# EAGLE schematic Rev 1 (EAGLE 9.2.2)

## Sheet 1 of 12: FPGA
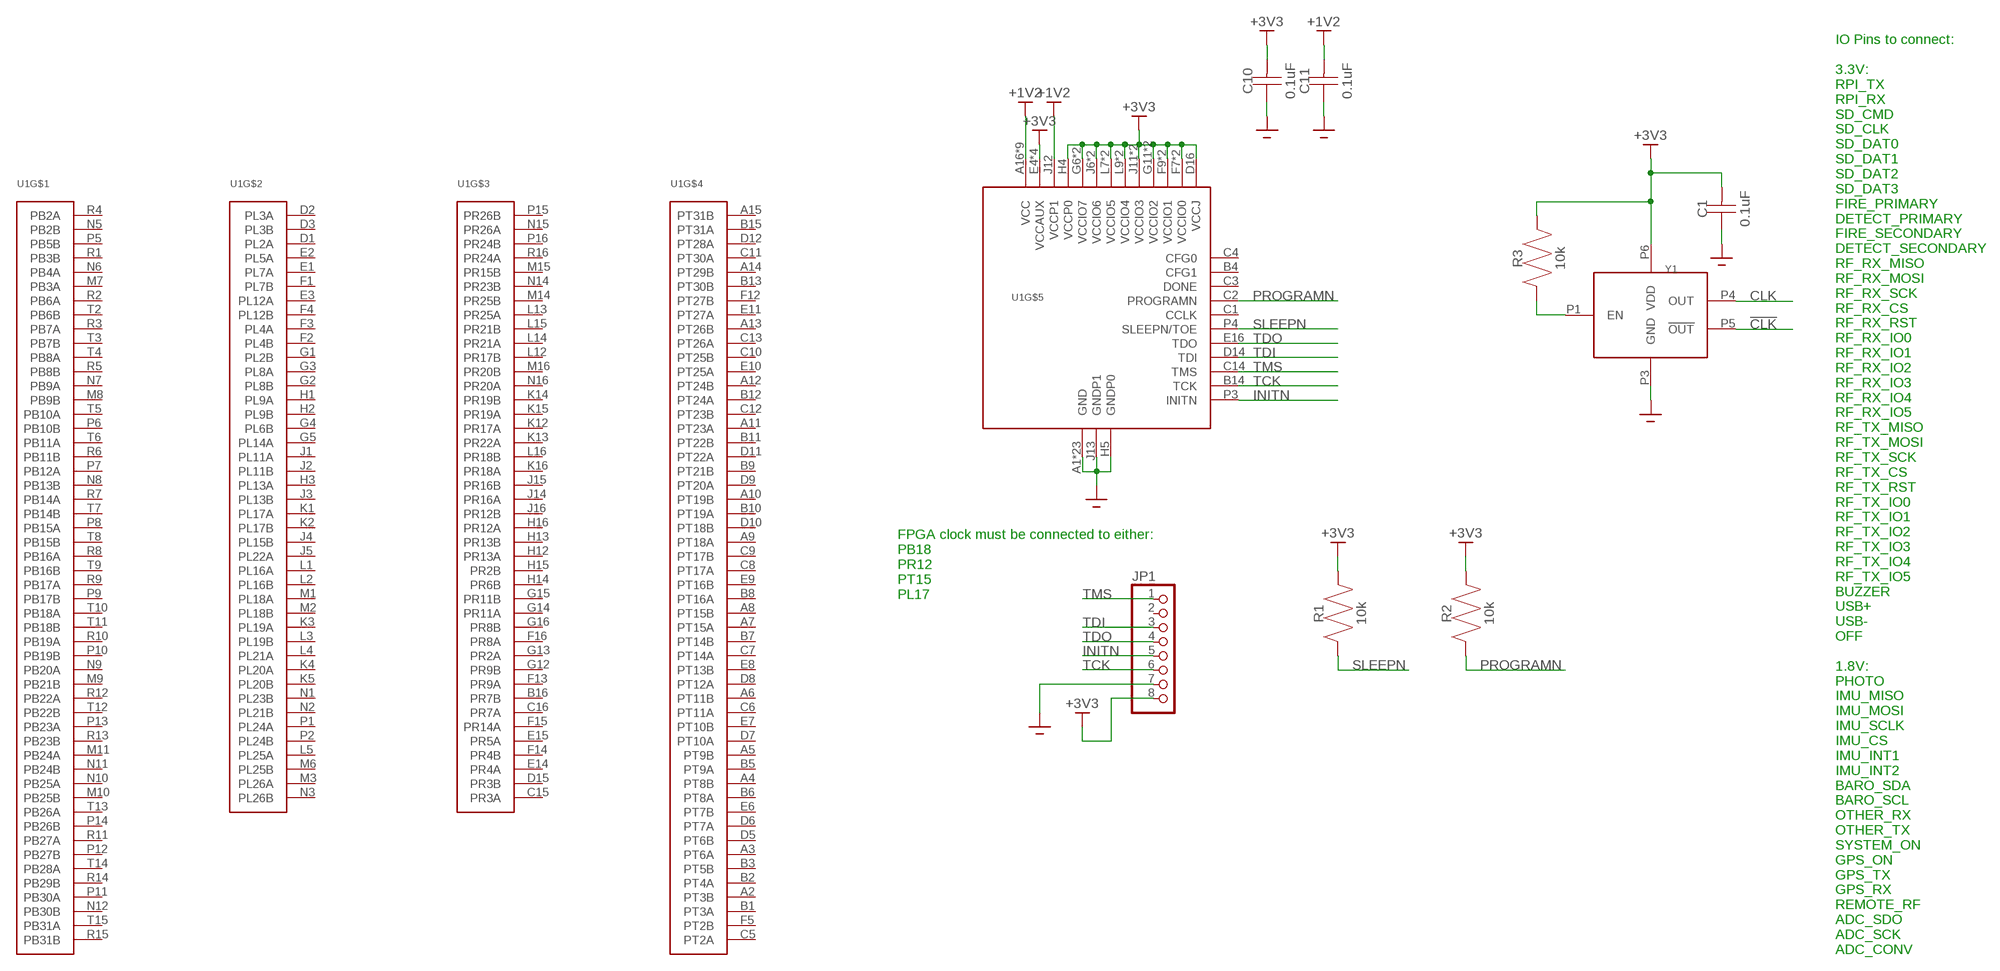
[diagram p0: schematic, sheet 1]

### Parts
C1  0.1uF  CAPACITOR0805  [0805]
C10  0.1uF  CAPACITOR0805  [0805]
C11  0.1uF  CAPACITOR0805  [0805]
JP1  PINHD-1X8  [1X08]
R1  10k  RESISTOR0805  [0805]
R2  10k  RESISTOR0805  [0805]
R3  10k  RESISTOR0805  [0805]
U1  LFXP6E-3FN256C  [FBGA256]
Y1  DSC1122B  [ICDFN500X320X90-4]

### Nets
!CLK: Y1.P5(!OUT)
+1V2: C11.P$2 U1.A16(VCC) U1.D4(VCC) U1.D13(VCC) U1.E5(VCC) U1.E12(VCC) U1.J12(VCCP1) U1.M5(VCC) U1.M12(VCC) U1.N4(VCC) U1.N13(VCC) ; also sheet 8,12
+3V3: C1.P$2 C10.P$2 JP1.8 R1.P$2 R2.P$2 R3.P$2 U1.D16(VCCJ) U1.E4(VCCAUX) U1.E13(VCCAUX) U1.F7(VCCIO0) U1.F8(VCCIO0) U1.F9(VCCIO1) U1.F10(VCCIO1) U1.G6(VCCIO7) U1.G11(VCCIO2) U1.H4(VCCP0) U1.H6(VCCIO7) U1.H11(VCCIO2) U1.J6(VCCIO6) U1.J11(VCCIO3) U1.K6(VCCIO6) U1.K11(VCCIO3) U1.L7(VCCIO5) U1.L8(VCCIO5) U1.L9(VCCIO4) U1.L10(VCCIO4) U1.M4(VCCAUX) U1.M13(VCCAUX) Y1.P6(VDD) ; also sheet 3,4,8,12
CLK: Y1.P4(OUT)
GND: C1.P$1 C10.P$1 C11.P$1 JP1.7 U1.A1(GND) U1.F6(GND) U1.F11(GND) U1.G7(GND) U1.G8(GND) U1.G9(GND) U1.G10(GND) U1.H5(GNDP0) U1.H7(GND) U1.H8(GND) U1.H9(GND) U1.H10(GND) U1.J7(GND) U1.J8(GND) U1.J9(GND) U1.J10(GND) U1.J13(GNDP1) U1.K7(GND) U1.K8(GND) U1.K9(GND) U1.K10(GND) U1.L6(GND) U1.L11(GND) U1.T1(GND) U1.T16(GND) Y1.P3(GND) ; also sheet 2,3,4,5,6,7,8,9,10,11,12
INITN: JP1.5 U1.P3(INITN)
N$1: R3.P$1 Y1.P1(EN)
PROGRAMN: R2.P$1 U1.C2(PROGRAMN)
SLEEPN: R1.P$1 U1.P4(SLEEPN/TOE)
TCK: JP1.6 U1.B14(TCK)
TDI: JP1.3 U1.D14(TDI)
TDO: JP1.4 U1.E16(TDO)
TMS: JP1.1 U1.C14(TMS)
Unconnected: JP1.2 U1.A2(PT3B) U1.A3(PT6A) U1.A4(PT8B) U1.A5(PT9B) U1.A6(PT11B) U1.A7(PT15A) U1.A8(PT15B) U1.A9(PT18A) U1.A10(PT19B) U1.A11(PT23A) U1.A12(PT24B) U1.A13(PT26B) U1.A14(PT29B) U1.A15(PT31B) U1.B1(PT3A) U1.B2(PT4A) U1.B3(PT5B) U1.B4(CFG1) U1.B5(PT9A) U1.B6(PT8A) U1.B7(PT14B) U1.B8(PT16A) U1.B9(PT21B) U1.B10(PT19A) U1.B11(PT22B) U1.B12(PT24A) U1.B13(PT30B) U1.B15(PT31A) U1.B16(PR7B) U1.C1(CCLK) U1.C3(DONE) U1.C4(CFG0) U1.C5(PT2A) U1.C6(PT11A) U1.C7(PT14A) U1.C8(PT17A) U1.C9(PT17B) U1.C10(PT25B) U1.C11(PT30A) U1.C12(PT23B) U1.C13(PT26A) U1.C15(PR3A) U1.C16(PR7A) U1.D1(PL2A) U1.D2(PL3A) U1.D3(PL3B) U1.D5(PT6B) U1.D6(PT7A) U1.D7(PT10A) U1.D8(PT12A) U1.D9(PT20A) U1.D10(PT18B) U1.D11(PT22A) U1.D12(PT28A) U1.D15(PR3B) U1.E1(PL7A) U1.E2(PL5A) U1.E3(PL12A) U1.E6(PT7B) U1.E7(PT10B) U1.E8(PT13B) U1.E9(PT16B) U1.E10(PT25A) U1.E11(PT27A) U1.E14(PR4A) U1.E15(PR5A) U1.F1(PL7B) U1.F2(PL4B) U1.F3(PL4A) U1.F4(PL12B) U1.F5(PT2B) U1.F12(PT27B) U1.F13(PR9A) U1.F14(PR4B) U1.F15(PR14A) U1.F16(PR8A) U1.G1(PL2B) U1.G2(PL8B) U1.G3(PL8A) U1.G4(PL6B) U1.G5(PL14A) U1.G12(PR9B) U1.G13(PR2A) U1.G14(PR11A) U1.G15(PR11B) U1.G16(PR8B) U1.H1(PL9A) U1.H2(PL9B) U1.H3(PL13A) U1.H12(PR13A) U1.H13(PR13B) U1.H14(PR6B) U1.H15(PR2B) U1.H16(PR12A) U1.J1(PL11A) U1.J2(PL11B) U1.J3(PL13B) U1.J4(PL15B) U1.J5(PL22A) U1.J14(PR16A) U1.J15(PR16B) U1.J16(PR12B) U1.K1(PL17A) U1.K2(PL17B) U1.K3(PL19A) U1.K4(PL20A) U1.K5(PL20B) U1.K12(PR17A) U1.K13(PR22A) U1.K14(PR19B) U1.K15(PR19A) U1.K16(PR18A) U1.L1(PL16A) U1.L2(PL16B) U1.L3(PL19B) U1.L4(PL21A) U1.L5(PL25A) U1.L12(PR17B) U1.L13(PR25A) U1.L14(PR21A) U1.L15(PR21B) U1.L16(PR18B) U1.M1(PL18A) U1.M2(PL18B) U1.M3(PL26A) U1.M6(PL25B) U1.M7(PB3A) U1.M8(PB9B) U1.M9(PB21B) U1.M10(PB25B) U1.M11(PB24A) U1.M14(PR25B) U1.M15(PR15B) U1.M16(PR20B) U1.N1(PL23B) U1.N2(PL21B) U1.N3(PL26B) U1.N5(PB2B) U1.N6(PB4A) U1.N7(PB9A) U1.N8(PB13B) U1.N9(PB20A) U1.N10(PB25A) U1.N11(PB24B) U1.N12(PB30B) U1.N14(PR23B) U1.N15(PR26A) U1.N16(PR20A) U1.P1(PL24A) U1.P2(PL24B) U1.P5(PB5B) U1.P6(PB10B) U1.P7(PB12A) U1.P8(PB15A) U1.P9(PB17B) U1.P10(PB19B) U1.P11(PB30A) U1.P12(PB27B) U1.P13(PB23A) U1.P14(PB26B) U1.P15(PR26B) U1.P16(PR24B) U1.R1(PB3B) U1.R2(PB6A) U1.R3(PB7A) U1.R4(PB2A) U1.R5(PB8B) U1.R6(PB11B) U1.R7(PB14A) U1.R8(PB16A) U1.R9(PB17A) U1.R10(PB19A) U1.R11(PB27A) U1.R12(PB22A) U1.R13(PB23B) U1.R14(PB29B) U1.R15(PB31B) U1.R16(PR24A) U1.T2(PB6B) U1.T3(PB7B) U1.T4(PB8A) U1.T5(PB10A) U1.T6(PB11A) U1.T7(PB14B) U1.T8(PB15B) U1.T9(PB16B) U1.T10(PB18A) U1.T11(PB18B) U1.T12(PB22B) U1.T13(PB26A) U1.T14(PB28A) U1.T15(PB31A)

### Notes on the sheet
- FPGA clock must be connected to either:
  PB18
  PR12
  PT15
  PL17
- IO Pins to connect:
  
  3.3V:
  RPI_TX
  RPI_RX
  SD_CMD
  SD_CLK
  SD_DAT0
  SD_DAT1
  SD_DAT2
  SD_DAT3
  FIRE_PRIMARY
  DETECT_PRIMARY
  FIRE_SECONDARY
  DETECT_SECONDARY
  RF_RX_MISO
  RF_RX_MOSI
  RF_RX_SCK
  RF_RX_CS
  RF_RX_RST
  RF_RX_IO0
  RF_RX_IO1
  RF_RX_IO2
  RF_RX_IO3
  RF_RX_IO4
  RF_RX_IO5
  RF_TX_MISO
  RF_TX_MOSI
  RF_TX_SCK
  RF_TX_CS
  RF_TX_RST
  RF_TX_IO0
  RF_TX_IO1
  RF_TX_IO2
  RF_TX_IO3
  RF_TX_IO4
  RF_TX_IO5
  BUZZER
  USB+
  USB-
  OFF
  
  1.8V:
  PHOTO
  IMU_MISO
  IMU_MOSI
  IMU_SCLK
  IMU_CS
  IMU_INT1
  IMU_INT2
  BARO_SDA
  BARO_SCL
  OTHER_RX
  OTHER_TX
  SYSTEM_ON
  GPS_ON
  GPS_TX
  GPS_RX
  REMOTE_RF
  ADC_SDO
  ADC_SCK
  ADC_CONV

## Sheet 2 of 12: Raspberry Pi
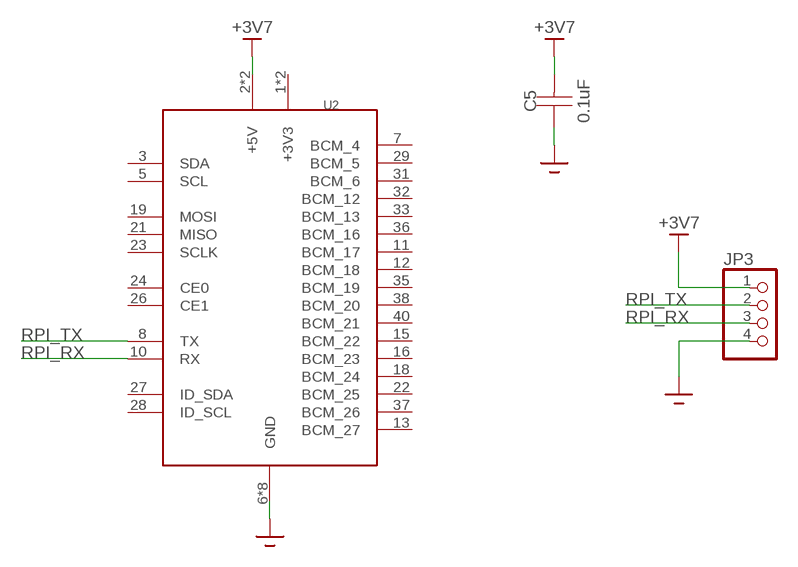
[diagram p1: schematic, sheet 2]

### Parts
C5  0.1uF  CAPACITOR0805  [0805]
JP3  PINHD-1X4  [1X04]
U2  RPI-ZERO  [RPI-ZERO]

### Nets
+3V7: C5.P$2 JP3.1 U2.2(+5V) U2.4(+5V) ; also sheet 4,5,7,9,11,12
GND: C5.P$1 JP3.4 U2.6(GND) U2.9(GND) U2.14(GND) U2.20(GND) U2.25(GND) U2.30(GND) U2.34(GND) U2.39(GND) ; also sheet 1,3,4,5,6,7,8,9,10,11,12
RPI_RX: JP3.3 U2.10(RX)
RPI_TX: JP3.2 U2.8(TX)
Unconnected: U2.3(SDA) U2.5(SCL) U2.7(BCM_4) U2.11(BCM_17) U2.12(BCM_18) U2.13(BCM_27) U2.15(BCM_22) U2.16(BCM_23) U2.18(BCM_24) U2.19(MOSI) U2.21(MISO) U2.22(BCM_25) U2.23(SCLK) U2.24(CE0) U2.26(CE1) U2.27(ID_SDA) U2.28(ID_SCL) U2.29(BCM_5) U2.31(BCM_6) U2.32(BCM_12) U2.33(BCM_13) U2.35(BCM_19) U2.36(BCM_16) U2.37(BCM_26) U2.38(BCM_20) U2.40(BCM_21)

## Sheet 3 of 12: SD Card
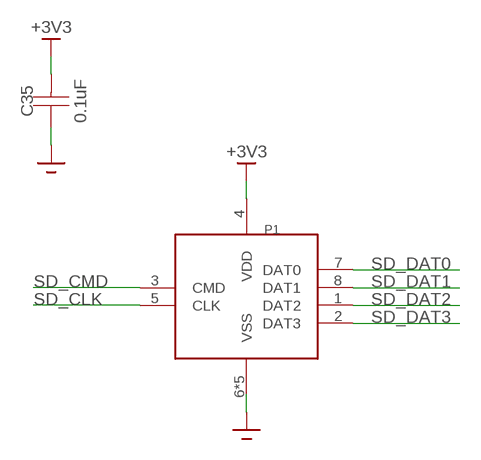
[diagram p2: schematic, sheet 3]

### Parts
C35  0.1uF  CAPACITOR0805  [0805]
P1  SDCARD  [0472192001]

### Nets
+3V3: C35.P$2 P1.4(VDD) ; also sheet 1,4,8,12
GND: C35.P$1 P1.6(VSS) P1.G1(VSS) P1.G2(VSS) P1.G3(VSS) P1.G4(VSS) ; also sheet 1,2,4,5,6,7,8,9,10,11,12
SD_CLK: P1.5(CLK)
SD_CMD: P1.3(CMD)
SD_DAT0: P1.7(DAT0)
SD_DAT1: P1.8(DAT1)
SD_DAT2: P1.1(DAT2)
SD_DAT3: P1.2(DAT3)

## Sheet 4 of 12: Pyro Charges
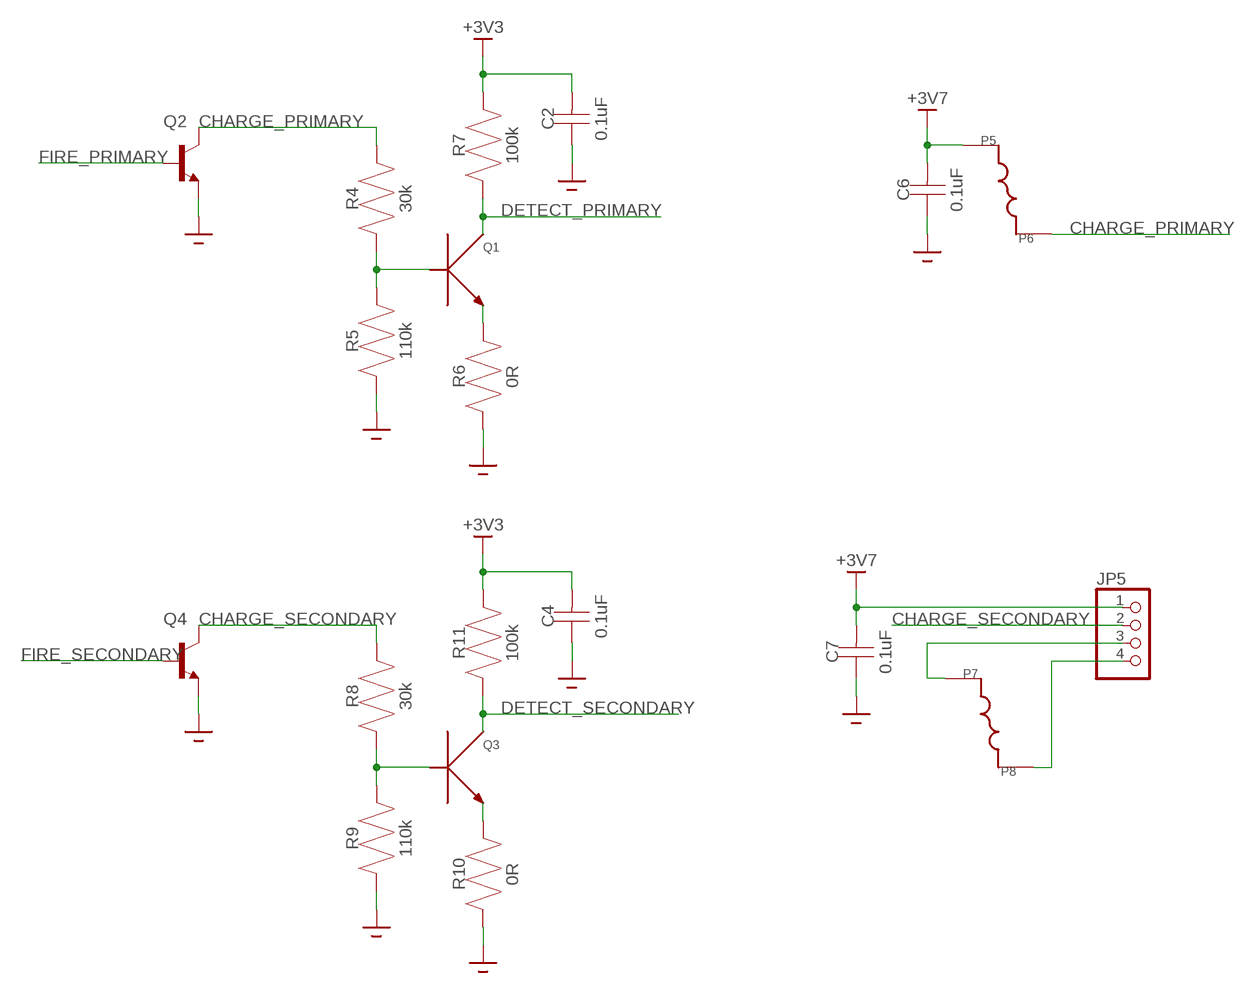
[diagram p3: schematic, sheet 4]

### Parts
C2  0.1uF  CAPACITOR0805  [0805]
C4  0.1uF  CAPACITOR0805  [0805]
C6  0.1uF  CAPACITOR0805  [0805]
C7  0.1uF  CAPACITOR0805  [0805]
JP5  PINHD-1X4  [1X04]
P5  EJECTION_CHARGE  [EJECTION_CHARGE]
P6  EJECTION_CHARGE  [EJECTION_CHARGE]
P7  EJECTION_CHARGE  [EJECTION_CHARGE]
P8  EJECTION_CHARGE  [EJECTION_CHARGE]
Q1  MMBT3904  [SOT96P237X112-3]
Q2  BCV27  [SOT23-3]
Q3  MMBT3904  [SOT96P237X112-3]
Q4  BCV27  [SOT23-3]
R4  30k  RESISTOR0805  [0805]
R5  110k  RESISTOR0805  [0805]
R6  0R  RESISTOR0805  [0805]
R7  100k  RESISTOR0805  [0805]
R8  30k  RESISTOR0805  [0805]
R9  110k  RESISTOR0805  [0805]
R10  0R  RESISTOR0805  [0805]
R11  100k  RESISTOR0805  [0805]

### Nets
+3V3: C2.P$2 C4.P$2 R7.P$2 R11.P$2 ; also sheet 1,3,8,12
+3V7: C6.P$2 C7.P$2 JP5.1 P5.P$1 ; also sheet 2,5,7,9,11,12
CHARGE_PRIMARY: P6.P$1 Q2.3(C) R4.P$2
CHARGE_SECONDARY: JP5.2 Q4.3(C) R8.P$2
DETECT_PRIMARY: Q1.3(C) R7.P$1
DETECT_SECONDARY: Q3.3(C) R11.P$1
FIRE_PRIMARY: Q2.1(B)
FIRE_SECONDARY: Q4.1(B)
GND: C2.P$1 C4.P$1 C6.P$1 C7.P$1 Q2.2(E) Q4.2(E) R5.P$1 R6.P$1 R9.P$1 R10.P$1 ; also sheet 1,2,3,5,6,7,8,9,10,11,12
N$2: Q1.2(E) R6.P$2
N$3: Q1.1(B) R4.P$1 R5.P$2
N$5: Q3.1(B) R8.P$1 R9.P$2
N$7: Q3.2(E) R10.P$2
N$64: JP5.3 P7.P$1
N$65: JP5.4 P8.P$1

## Sheet 5 of 12: Sensors
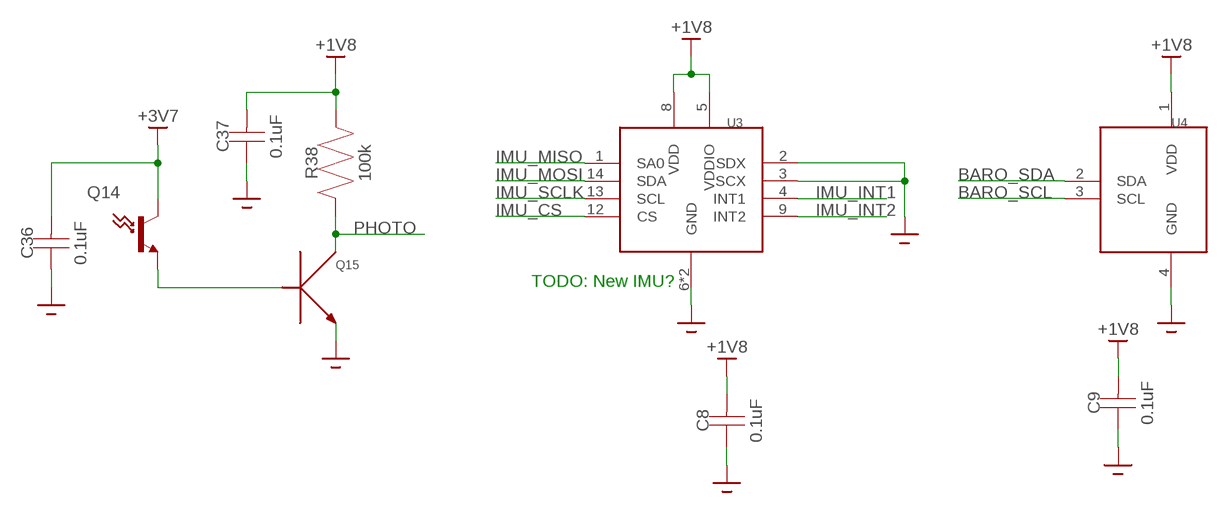
[diagram p4: schematic, sheet 5]

### Parts
C8  0.1uF  CAPACITOR0805  [0805]
C9  0.1uF  CAPACITOR0805  [0805]
C36  0.1uF  CAPACITOR0805  [0805]
C37  0.1uF  CAPACITOR0805  [0805]
Q14  PHOTOTRANSISTOR  [LEDC2708X60N]
Q15  MMBT3904  [SOT96P237X112-3]
R38  100k  RESISTOR0805  [0805]
U3  LSM6DS3  [LSM6DS3]
U4  MS5637-02BA03  [ICDFN300X300X90-4]

### Nets
+1V8: C8.P$2 C9.P$2 C37.P$2 R38.P$2 U3.5(VDDIO) U3.8(VDD) U4.1(VDD) ; also sheet 6,7,10,12
+3V7: C36.P$2 Q14.1(C) ; also sheet 2,4,7,9,11,12
BARO_SCL: U4.3(SCL)
BARO_SDA: U4.2(SDA)
GND: C8.P$1 C9.P$1 C36.P$1 C37.P$1 Q15.2(E) U3.2(SDX) U3.3(SCX) U3.6(GND) U3.7(GND) U4.4(GND) ; also sheet 1,2,3,4,6,7,8,9,10,11,12
IMU_CS: U3.12(CS)
IMU_INT1: U3.4(INT1)
IMU_INT2: U3.9(INT2)
IMU_MISO: U3.1(SA0)
IMU_MOSI: U3.14(SDA)
IMU_SCLK: U3.13(SCL)
N$66: Q14.2(E) Q15.1(B)
PHOTO: Q15.3(C) R38.P$1

### Notes on the sheet
- TODO: New IMU?

## Sheet 6 of 12: Inter-Board Communication
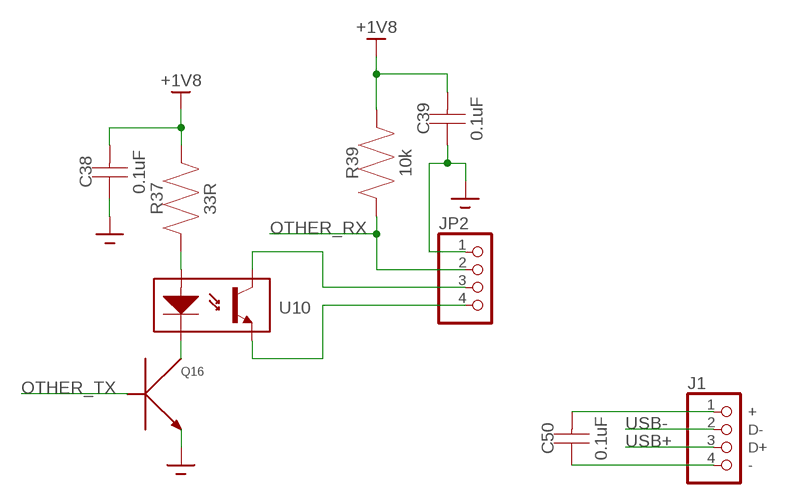
[diagram p5: schematic, sheet 6]

### Parts
C38  0.1uF  CAPACITOR0805  [0805]
C39  0.1uF  CAPACITOR0805  [0805]
C50  0.1uF  CAPACITOR0805  [0805]
J1  USB  [USB]
JP2  PINHD-1X4  [1X04]
Q16  MMBT3904  [SOT96P237X112-3]
R37  33R  RESISTOR0805  [0805]
R39  10k  RESISTOR0805  [0805]
U10  LTV-357T  [LTV-357T]

### Nets
+1V8: C38.P$2 C39.P$2 R37.P$2 R39.P$2 ; also sheet 5,7,10,12
GND: C38.P$1 C39.P$1 JP2.1 Q16.2(E) ; also sheet 1,2,3,4,5,7,8,9,10,11,12
N$67: R37.P$1 U10.1(ANODE)
N$68: JP2.3 U10.4(COLLECTOR)
N$69: JP2.4 U10.3(EMITTER)
N$71: Q16.3(C) U10.2(CATHODE)
N$82: C50.P$2 J1.1(+)
N$83: C50.P$1 J1.4(-)
OTHER_RX: JP2.2 R39.P$1
OTHER_TX: Q16.1(B)
USB+: J1.3(D+)
USB-: J1.2(D-)

## Sheet 7 of 12: GPS
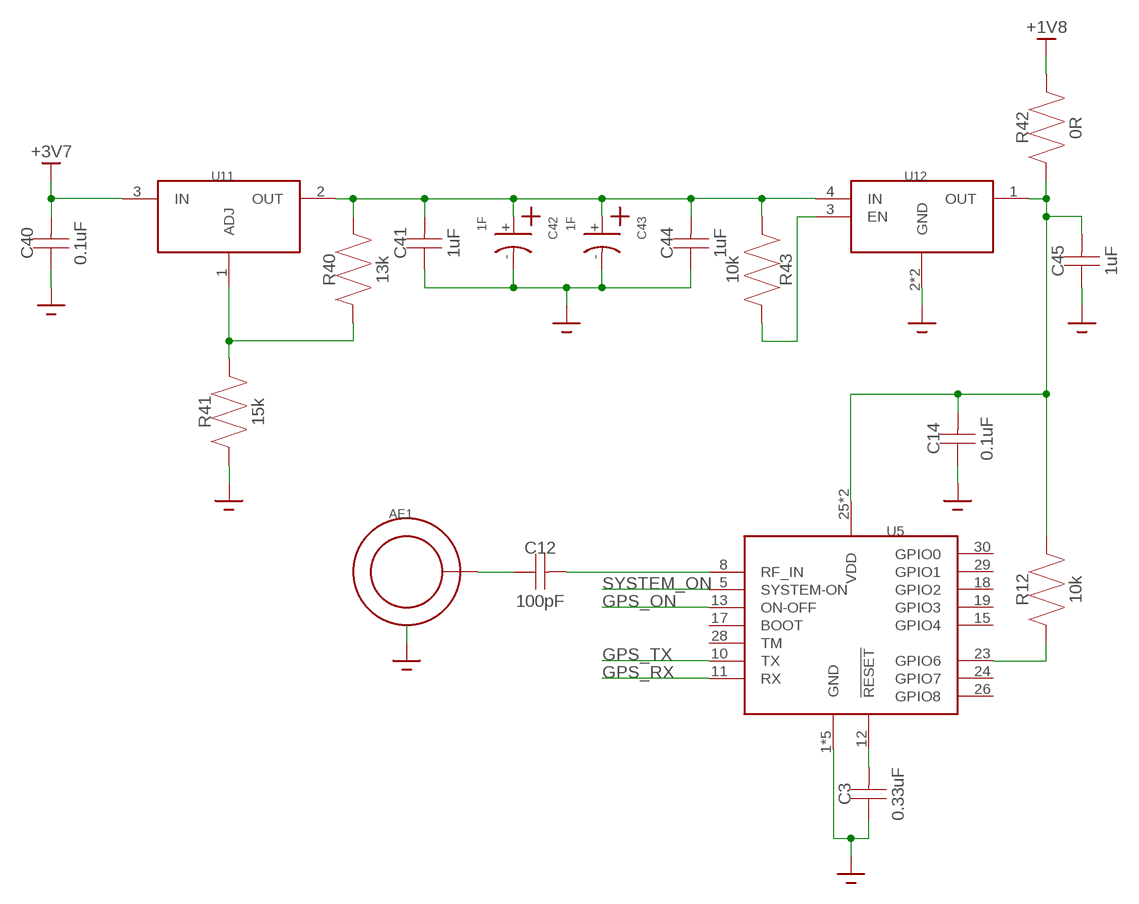
[diagram p6: schematic, sheet 7]

### Parts
AE1  5-1814832-1  [5-1814832-1]
C3  0.33uF  CAPACITOR0805  [0805]
C12  100pF  CAPACITOR0805  [0805]
C14  0.1uF  CAPACITOR0805  [0805]
C40  0.1uF  CAPACITOR0805  [0805]
C41  1uF  CAPACITOR0805  [0805]
C42  1F  ELECTROLYTIC  [JUWT1105MCD]
C43  1F  ELECTROLYTIC  [JUWT1105MCD]
C44  1uF  CAPACITOR0805  [0805]
C45  1uF  CAPACITOR0805  [0805]
R12  10k  RESISTOR0805  [0805]
R40  13k  RESISTOR0805  [0805]
R41  15k  RESISTOR0805  [0805]
R42  0R  RESISTOR0805  [0805]
R43  10k  RESISTOR0805  [0805]
U5  JF2  [QFN100P1100X1100X100-32]
U11  LDO_ADJLM317BD2TR4G  [LM317BD2TR4G]
U12  LDO_ENLDLN025PU18R  [LDLN025PU18R]

### Nets
+1V8: R42.P$2 ; also sheet 5,6,10,12
+3V7: C40.P$2 U11.3(IN) ; also sheet 2,4,5,9,11,12
GND: AE1.G1(GND) AE1.G2(GND) AE1.G3(GND) AE1.G4(GND) C3.P$1 C14.P$1 C40.P$1 C41.P$1 C42.- C43.- C44.P$1 C45.P$1 R41.P$1 U5.1(GND) U5.7(GND) U5.9(GND) U5.21(GND) U5.31(GND) U12.2(GND) U12.G(GND) ; also sheet 1,2,3,4,5,6,8,9,10,11,12
GPS_ON: U5.13(ON-OFF)
GPS_RX: U5.11(RX)
GPS_TX: U5.10(TX)
N$4: C3.P$2 U5.12(!RESET)
N$6: C12.P$2 U5.8(RF_IN)
N$8: R12.P$1 U5.23(GPIO6)
N$9: AE1.OUT C12.P$1
N$70: C14.P$2 C45.P$2 R12.P$2 R42.P$1 U5.25(VDD) U5.32(VDD) U12.1(OUT)
N$74: R40.P$1 R41.P$2 U11.1(ADJ)
N$75: R43.P$2 U12.3(EN)
N$77: C41.P$2 C42.+ C43.+ C44.P$2 R40.P$2 R43.P$1 U11.2(OUT) U12.4(IN)
SYSTEM_ON: U5.5(SYSTEM-ON)
Unconnected: U5.15(GPIO4) U5.17(BOOT) U5.18(GPIO2) U5.19(GPIO3) U5.24(GPIO7) U5.26(GPIO8) U5.28(TM) U5.29(GPIO1) U5.30(GPIO0)

## Sheet 8 of 12: RF
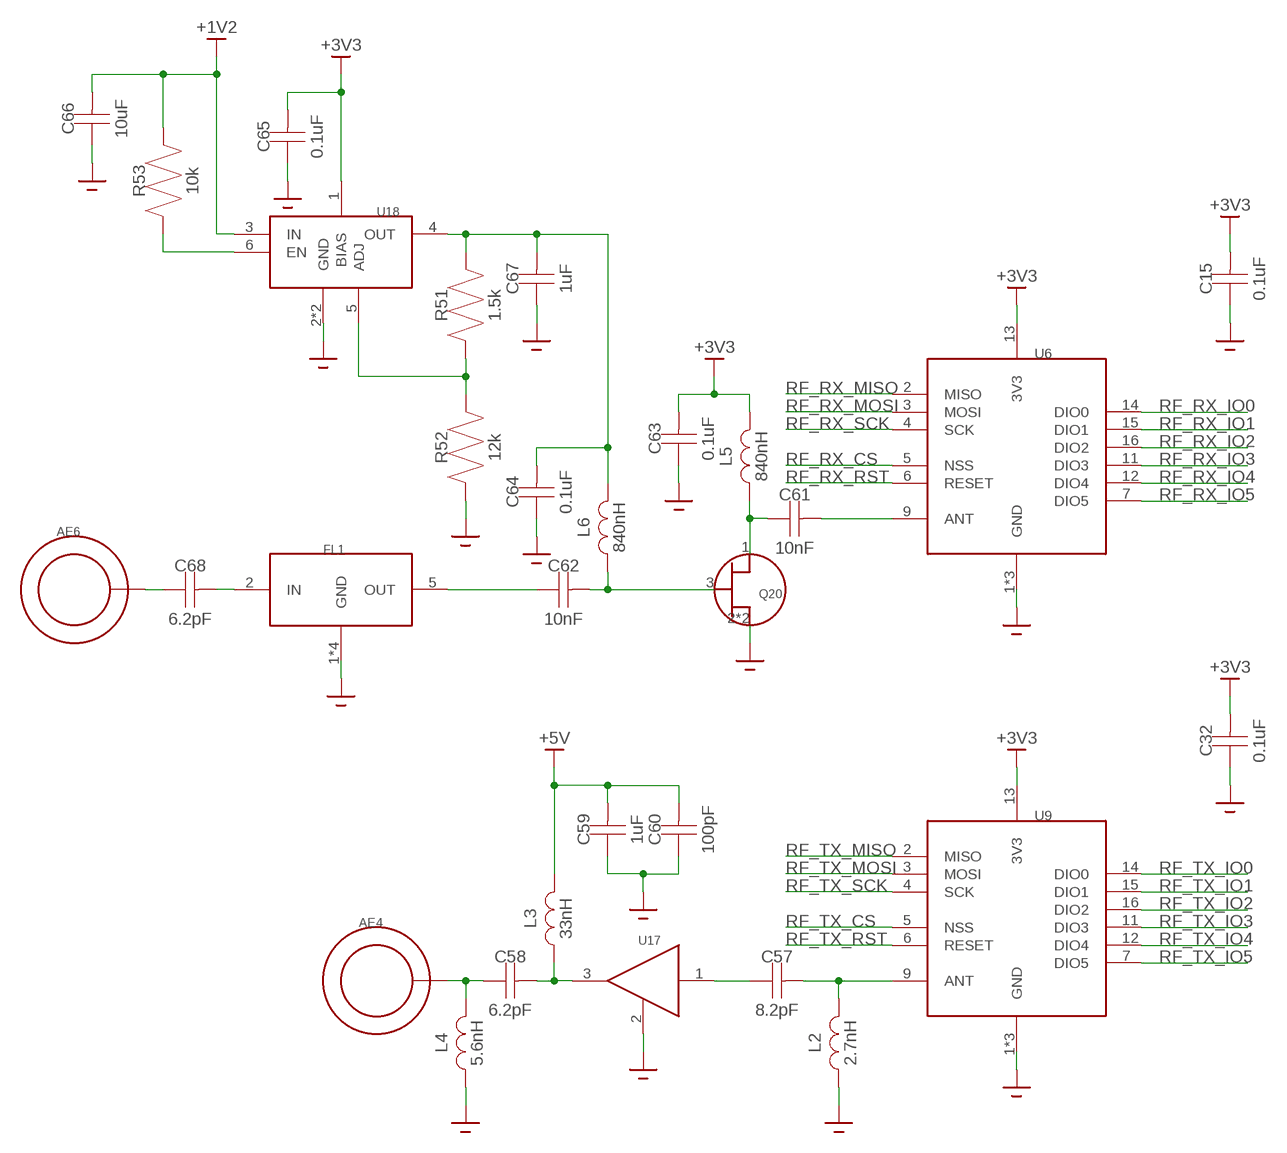
[diagram p7: schematic, sheet 8]

### Parts
AE4  5-1814832-1  [5-1814832-1]
AE6  5-1814832-1  [5-1814832-1]
C15  0.1uF  CAPACITOR0805  [0805]
C32  0.1uF  CAPACITOR0805  [0805]
C57  8.2pF  CAPACITOR0805  [0805]
C58  6.2pF  CAPACITOR0805  [0805]
C59  1uF  CAPACITOR0805  [0805]
C60  100pF  CAPACITOR0805  [0805]
C61  10nF  CAPACITOR0805  [0805]
C62  10nF  CAPACITOR0805  [0805]
C63  0.1uF  CAPACITOR0805  [0805]
C64  0.1uF  CAPACITOR0805  [0805]
C65  0.1uF  CAPACITOR0805  [0805]
C66  10uF  CAPACITOR0805  [0805]
C67  1uF  CAPACITOR0805  [0805]
C68  6.2pF  CAPACITOR0805  [0805]
FL1  SAWAFS915.0W03-TS4  [SON120P300X300X150-6N]
L2  2.7nH  INDUCTOR  [0805]
L3  33nH  INDUCTOR  [0805]
L4  5.6nH  INDUCTOR  [0805]
L5  840nH  INDUCTOR  [0805]
L6  840nH  INDUCTOR  [0805]
Q20  TAV-541+  [TAV-541+]
R51  1.5k  RESISTOR0805  [0805]
R52  12k  RESISTOR0805  [0805]
R53  10k  RESISTOR0805  [0805]
U6  RFM69HCW  [RFM69HCW]
U9  RFM69HCW  [RFM69HCW]
U17  GVA-91+  [GVA-91+]
U18  MIC47050  [SON65P200X200X90-7T80X140N]

### Nets
+1V2: C66.P$2 R53.P$2 U18.3(IN) ; also sheet 1,12
+3V3: C15.P$2 C32.P$2 C63.P$2 C65.P$2 L5.P$2 U6.13(3V3) U9.13(3V3) U18.1(BIAS) ; also sheet 1,3,4,12
+5V: C59.P$2 C60.P$2 L3.P$2 ; also sheet 12
GND: C15.P$1 C32.P$1 C59.P$1 C60.P$1 C63.P$1 C64.P$1 C65.P$1 C66.P$1 C67.P$1 FL1.1(GND) FL1.3(GND) FL1.4(GND) FL1.6(GND) L2.P$1 L4.P$1 Q20.2(S) Q20.4(S) R52.P$1 U6.1(GND) U6.8(GND) U6.10(GND) U9.1(GND) U9.8(GND) U9.10(GND) U17.2(GND) U18.2(GND) U18.7(GND) ; also sheet 1,2,3,4,5,6,7,9,10,11,12
N$17: C57.P$1 U17.1(IN)
N$62: C57.P$2 L2.P$2 U9.9(ANT)
N$79: C62.P$2 L6.P$1 Q20.3(G)
N$81: C64.P$2 C67.P$2 L6.P$2 R51.P$2 U18.4(OUT)
N$85: C58.P$2 L3.P$1 U17.3(OUT)
N$88: C61.P$2 U6.9(ANT)
N$89: AE4.OUT C58.P$1 L4.P$2
N$90: C61.P$1 L5.P$1 Q20.1(D)
N$91: R53.P$1 U18.6(EN)
N$92: R51.P$1 R52.P$2 U18.5(ADJ)
N$93: C62.P$1 FL1.5(OUT)
N$94: C68.P$2 FL1.2(IN)
N$95: AE6.OUT C68.P$1
RF_RX_CS: U6.5(NSS)
RF_RX_IO0: U6.14(DIO0)
RF_RX_IO1: U6.15(DIO1)
RF_RX_IO2: U6.16(DIO2)
RF_RX_IO3: U6.11(DIO3)
RF_RX_IO4: U6.12(DIO4)
RF_RX_IO5: U6.7(DIO5)
RF_RX_MISO: U6.2(MISO)
RF_RX_MOSI: U6.3(MOSI)
RF_RX_RST: U6.6(RESET)
RF_RX_SCK: U6.4(SCK)
RF_TX_CS: U9.5(NSS)
RF_TX_IO0: U9.14(DIO0)
RF_TX_IO1: U9.15(DIO1)
RF_TX_IO2: U9.16(DIO2)
RF_TX_IO3: U9.11(DIO3)
RF_TX_IO4: U9.12(DIO4)
RF_TX_IO5: U9.7(DIO5)
RF_TX_MISO: U9.2(MISO)
RF_TX_MOSI: U9.3(MOSI)
RF_TX_RST: U9.6(RESET)
RF_TX_SCK: U9.4(SCK)
Unconnected: AE4.G1(GND) AE4.G2(GND) AE4.G3(GND) AE4.G4(GND) AE6.G1(GND) AE6.G2(GND) AE6.G3(GND) AE6.G4(GND)

## Sheet 9 of 12: Buzzer
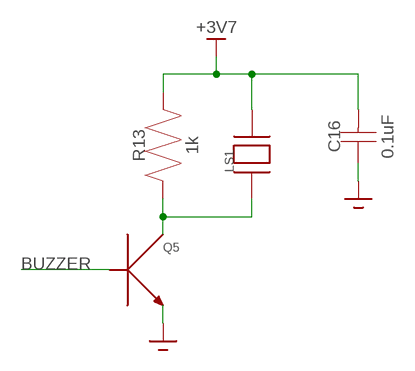
[diagram p8: schematic, sheet 9]

### Parts
C16  0.1uF  CAPACITOR0805  [0805]
LS1  PKM13EPYH4000-A0  [PKM13EPYH4000-A0]
Q5  MMBT3904  [SOT96P237X112-3]
R13  1k  RESISTOR0805  [0805]

### Nets
+3V7: C16.P$2 LS1.P2 R13.P$2 ; also sheet 2,4,5,7,11,12
BUZZER: Q5.1(B)
GND: C16.P$1 Q5.2(E) ; also sheet 1,2,3,4,5,6,7,8,10,11,12
N$10: LS1.P1 Q5.3(C) R13.P$1

## Sheet 10 of 12: Wireless On/Off
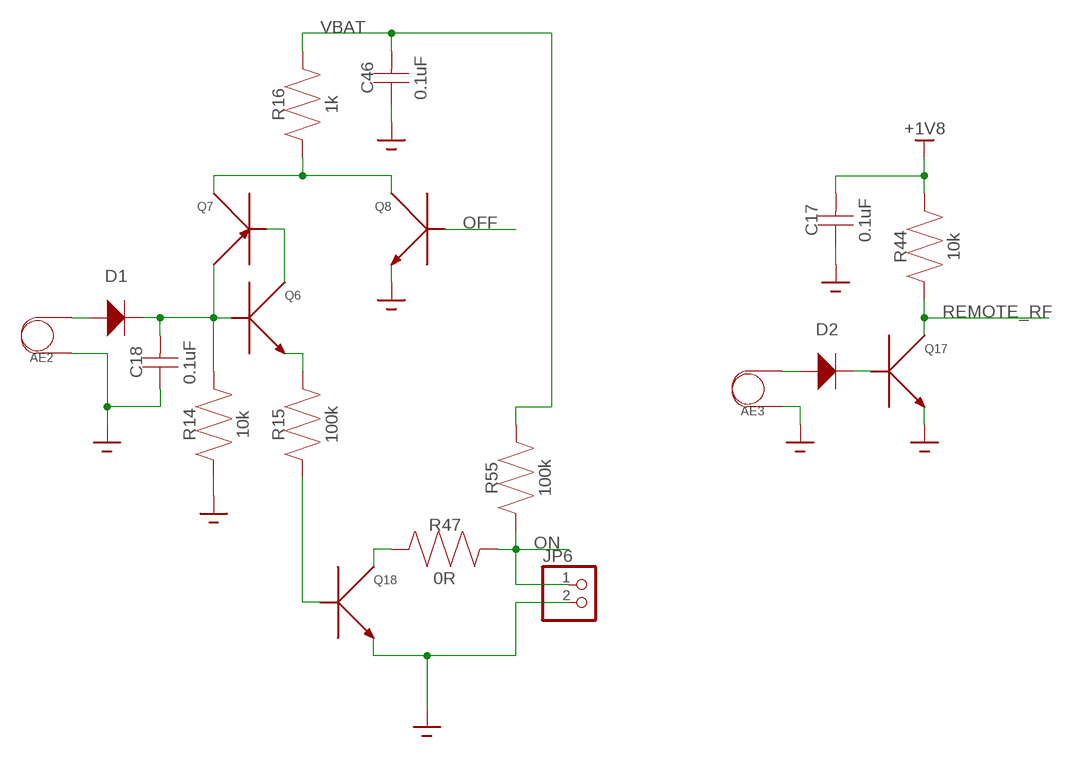
[diagram p9: schematic, sheet 10]

### Parts
AE2  ANTENNA  [ANTENNA]
AE3  ANTENNA  [ANTENNA]
C17  0.1uF  CAPACITOR0805  [0805]
C18  0.1uF  CAPACITOR0805  [0805]
C46  0.1uF  CAPACITOR0805  [0805]
D1  LS56  [DIOC5027X108]
D2  LS56  [DIOC5027X108]
JP6  PINHD-1X2  [1X02]
Q6  MMBT3904  [SOT96P237X112-3]
Q7  MMBT3906  [SOT96P237X112-3]
Q8  MMBT3904  [SOT96P237X112-3]
Q17  MMBT3904  [SOT96P237X112-3]
Q18  MMBT3904  [SOT96P237X112-3]
R14  10k  RESISTOR0805  [0805]
R15  100k  RESISTOR0805  [0805]
R16  1k  RESISTOR0805  [0805]
R44  10k  RESISTOR0805  [0805]
R47  0R  RESISTOR0805  [0805]
R55  100k  RESISTOR0805  [0805]

### Nets
+1V8: C17.P$2 R44.P$2 ; also sheet 5,6,7,12
GND: AE2.P$1 AE3.P$1 C17.P$1 C18.P$1 C46.P$1 JP6.2 Q8.2(E) Q17.2(E) Q18.2(E) R14.P$1 ; also sheet 1,2,3,4,5,6,7,8,9,11,12
N$11: Q6.3(C) Q7.1(B)
N$12: C18.P$2 D1.2(OUT) Q6.1(B) Q7.2(E) R14.P$2
N$13: Q6.2(E) R15.P$2
N$14: AE2.P$2 D1.1(IN)
N$15: AE3.P$2 D2.1(IN)
N$16: Q7.3(C) Q8.3(C) R16.P$1
N$72: D2.2(OUT) Q17.1(B)
N$76: Q18.1(B) R15.P$1
N$78: Q18.3(C) R47.P$1
OFF: Q8.1(B)
ON: JP6.1 R47.P$2 R55.P$1 ; also sheet 12
REMOTE_RF: Q17.3(C) R44.P$1
VBAT: C46.P$2 R16.P$2 R55.P$2 ; also sheet 12

## Sheet 11 of 12: Wireless Remote
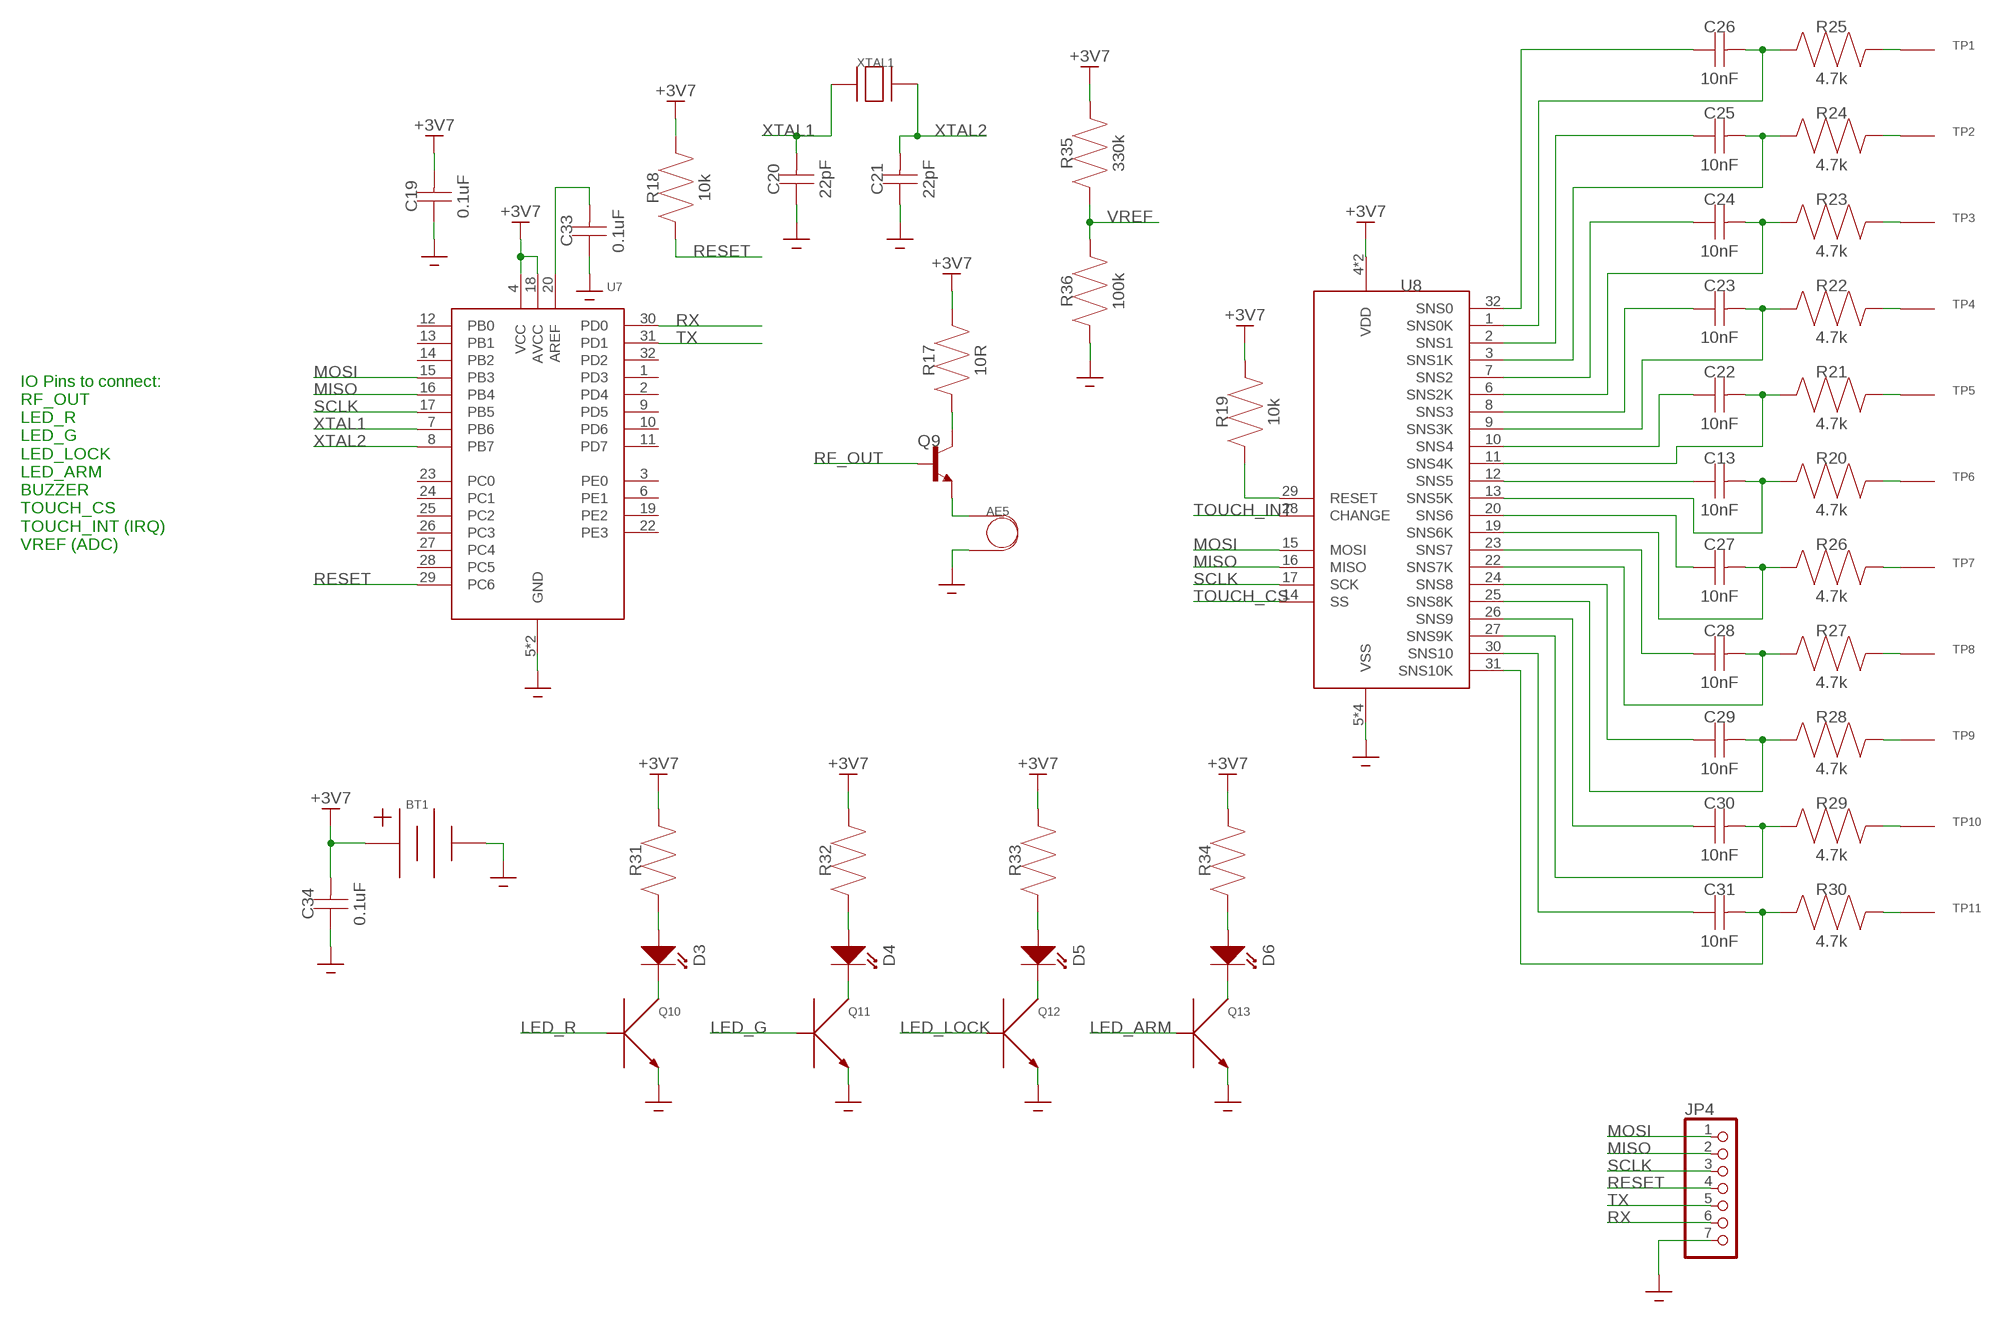
[diagram p10: schematic, sheet 11]

### Parts
AE5  ANTENNA  [ANTENNA]
BT1  18650  [18650]
C13  10nF  CAPACITOR0805  [0805]
C19  0.1uF  CAPACITOR0805  [0805]
C20  22pF  CAPACITOR0805  [0805]
C21  22pF  CAPACITOR0805  [0805]
C22  10nF  CAPACITOR0805  [0805]
C23  10nF  CAPACITOR0805  [0805]
C24  10nF  CAPACITOR0805  [0805]
C25  10nF  CAPACITOR0805  [0805]
C26  10nF  CAPACITOR0805  [0805]
C27  10nF  CAPACITOR0805  [0805]
C28  10nF  CAPACITOR0805  [0805]
C29  10nF  CAPACITOR0805  [0805]
C30  10nF  CAPACITOR0805  [0805]
C31  10nF  CAPACITOR0805  [0805]
C33  0.1uF  CAPACITOR0805  [0805]
C34  0.1uF  CAPACITOR0805  [0805]
D3  LED  [0805]
D4  LED  [0805]
D5  LED  [0805]
D6  LED  [0805]
JP4  PINHD-1X7  [1X07]
Q9  BCV27  [SOT23-3]
Q10  MMBT3904  [SOT96P237X112-3]
Q11  MMBT3904  [SOT96P237X112-3]
Q12  MMBT3904  [SOT96P237X112-3]
Q13  MMBT3904  [SOT96P237X112-3]
R17  10R  RESISTOR0805  [0805]
R18  10k  RESISTOR0805  [0805]
R19  10k  RESISTOR0805  [0805]
R20  4.7k  RESISTOR0805  [0805]
R21  4.7k  RESISTOR0805  [0805]
R22  4.7k  RESISTOR0805  [0805]
R23  4.7k  RESISTOR0805  [0805]
R24  4.7k  RESISTOR0805  [0805]
R25  4.7k  RESISTOR0805  [0805]
R26  4.7k  RESISTOR0805  [0805]
R27  4.7k  RESISTOR0805  [0805]
R28  4.7k  RESISTOR0805  [0805]
R29  4.7k  RESISTOR0805  [0805]
R30  4.7k  RESISTOR0805  [0805]
R31  RESISTOR0805  [0805]
R32  RESISTOR0805  [0805]
R33  RESISTOR0805  [0805]
R34  RESISTOR0805  [0805]
R35  330k  RESISTOR0805  [0805]
R36  100k  RESISTOR0805  [0805]
TP1  TOUCH_POINTBTN  [TOUCH_BTN]
TP2  TOUCH_POINTBTN  [TOUCH_BTN]
TP3  TOUCH_POINTSTRIP  [TOUCH_STRIP]
TP4  TOUCH_POINTSTRIP  [TOUCH_STRIP]
TP5  TOUCH_POINTSTRIP  [TOUCH_STRIP]
TP6  TOUCH_POINTSTRIP  [TOUCH_STRIP]
TP7  TOUCH_POINTSTRIP  [TOUCH_STRIP]
TP8  TOUCH_POINTSTRIP  [TOUCH_STRIP]
TP9  TOUCH_POINTSTRIP  [TOUCH_STRIP]
TP10  TOUCH_POINTSTRIP  [TOUCH_STRIP]
TP11  TOUCH_POINTSTRIP  [TOUCH_STRIP]
U7  ATMEGA328PB32-TQFP  [QFP80P900X900X120-32]
U8  AT42QT1110  [QFN50P500X500X100-33T310]
XTAL1  CRYSTAL  [ABM2]

### Nets
+3V7: BT1.+1(+) BT1.+2(+) BT1.+3(+) C19.P$2 C34.P$2 R17.P$2 R18.P$2 R19.P$2 R31.P$2 R32.P$2 R33.P$2 R34.P$2 R35.P$2 U7.4(VCC) U7.18(AVCC) U8.4(VDD) U8.18(VDD) ; also sheet 2,4,5,7,9,12
GND: AE5.P$2 BT1.-1(-) BT1.-2(-) BT1.-3(-) C19.P$1 C20.P$1 C21.P$1 C33.P$1 C34.P$1 JP4.7 Q10.2(E) Q11.2(E) Q12.2(E) Q13.2(E) R36.P$1 U7.5(GND) U7.21(GND) U8.5(VSS) U8.21(VSS) U8.33(VSS) U8.34(VSS) ; also sheet 1,2,3,4,5,6,7,8,9,10,12
LED_ARM: Q13.1(B)
LED_G: Q11.1(B)
LED_LOCK: Q12.1(B)
LED_R: Q10.1(B)
MISO: JP4.2 U7.16(PB4) U8.16(MISO)
MOSI: JP4.1 U7.15(PB3) U8.15(MOSI)
N$18: AE5.P$1 Q9.2(E)
N$19: R19.P$1 U8.29(RESET)
N$20: Q9.3(C) R17.P$1
N$21: C13.P$1 U8.12(SNS5)
N$22: C13.P$2 R20.P$1 U8.13(SNS5K)
N$23: C27.P$2 R26.P$1 U8.19(SNS6K)
N$24: C28.P$2 R27.P$1 U8.22(SNS7K)
N$25: C29.P$2 R28.P$1 U8.25(SNS8K)
N$26: C30.P$2 R29.P$1 U8.27(SNS9K)
N$27: C31.P$2 R30.P$1 U8.31(SNS10K)
N$28: C22.P$2 R21.P$1 U8.11(SNS4K)
N$29: C23.P$2 R22.P$1 U8.9(SNS3K)
N$30: C24.P$2 R23.P$1 U8.6(SNS2K)
N$31: C25.P$2 R24.P$1 U8.3(SNS1K)
N$32: C26.P$2 R25.P$1 U8.1(SNS0K)
N$33: C27.P$1 U8.20(SNS6)
N$34: C28.P$1 U8.23(SNS7)
N$35: C29.P$1 U8.24(SNS8)
N$36: C30.P$1 U8.26(SNS9)
N$37: C31.P$1 U8.30(SNS10)
N$38: C22.P$1 U8.10(SNS4)
N$39: C23.P$1 U8.8(SNS3)
N$40: C24.P$1 U8.7(SNS2)
N$41: C25.P$1 U8.2(SNS1)
N$42: C26.P$1 U8.32(SNS0)
N$43: R30.P$2 TP11.P$1
N$44: R29.P$2 TP10.P$1
N$45: R28.P$2 TP9.P$1
N$46: R27.P$2 TP8.P$1
N$47: R26.P$2 TP7.P$1
N$48: R20.P$2 TP6.P$1
N$49: R21.P$2 TP5.P$1
N$50: R22.P$2 TP4.P$1
N$51: R23.P$2 TP3.P$1
N$52: R24.P$2 TP2.P$1
N$53: R25.P$2 TP1.P$1
N$54: D3.P$2(OUT) Q10.3(C)
N$55: D3.P$1(IN) R31.P$1
N$56: D4.P$2(OUT) Q11.3(C)
N$57: D4.P$1(IN) R32.P$1
N$58: D5.P$2(OUT) Q12.3(C)
N$59: D5.P$1(IN) R33.P$1
N$60: D6.P$2(OUT) Q13.3(C)
N$61: D6.P$1(IN) R34.P$1
N$63: C33.P$2 U7.20(AREF)
RESET: JP4.4 R18.P$1 U7.29(PC6)
RF_OUT: Q9.1(B)
RX: JP4.6 U7.30(PD0)
SCLK: JP4.3 U7.17(PB5) U8.17(SCK)
TOUCH_CS: U8.14(SS)
TOUCH_INT: U8.28(CHANGE)
TX: JP4.5 U7.31(PD1)
VREF: R35.P$1 R36.P$2
XTAL1: C20.P$2 U7.7(PB6) XTAL1.P$1
XTAL2: C21.P$2 U7.8(PB7) XTAL1.P$2
Unconnected: U7.1(PD3) U7.2(PD4) U7.3(PE0) U7.6(PE1) U7.9(PD5) U7.10(PD6) U7.11(PD7) U7.12(PB0) U7.13(PB1) U7.14(PB2) U7.19(PE2) U7.22(PE3) U7.23(PC0) U7.24(PC1) U7.25(PC2) U7.26(PC3) U7.27(PC4) U7.28(PC5) U7.32(PD2)

### Notes on the sheet
- IO Pins to connect:
  RF_OUT
  LED_R
  LED_G
  LED_LOCK
  LED_ARM
  BUZZER
  TOUCH_CS
  TOUCH_INT (IRQ)
  VREF (ADC)

## Sheet 12 of 12: Power
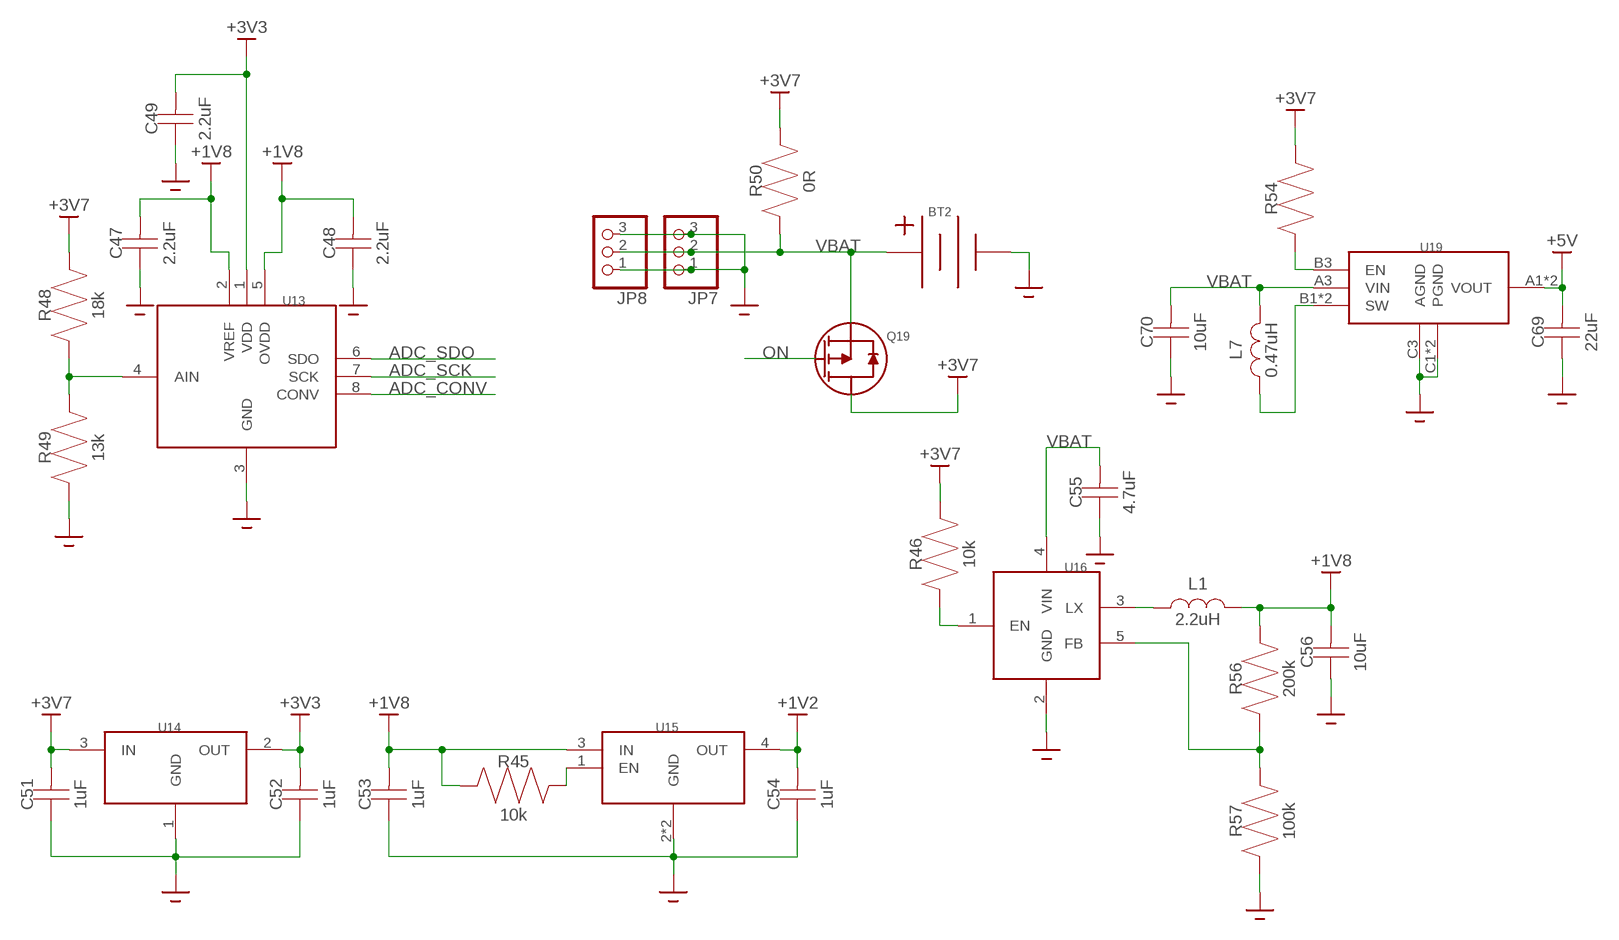
[diagram p11: schematic, sheet 12]

### Parts
BT2  18650  [18650]
C47  2.2uF  CAPACITOR0805  [0805]
C48  2.2uF  CAPACITOR0805  [0805]
C49  2.2uF  CAPACITOR0805  [0805]
C51  1uF  CAPACITOR0805  [0805]
C52  1uF  CAPACITOR0805  [0805]
C53  1uF  CAPACITOR0805  [0805]
C54  1uF  CAPACITOR0805  [0805]
C55  4.7uF  CAPACITOR0805  [0805]
C56  10uF  CAPACITOR0805  [0805]
C69  22uF  CAPACITOR0805  [0805]
C70  10uF  CAPACITOR0805  [0805]
JP7  PINHD-1X3  [1X03]
JP8  PINHD-1X3  [1X03]
L1  2.2uH  INDUCTOR  [0805]
L7  0.47uH  INDUCTOR  [0805]
Q19  P-MOSFETTPH1R712MD  [SOIC127P600X100-8N]
R45  10k  RESISTOR0805  [0805]
R46  10k  RESISTOR0805  [0805]
R48  18k  RESISTOR0805  [0805]
R49  13k  RESISTOR0805  [0805]
R50  0R  RESISTOR0805  [0805]
R54  RESISTOR0805  [0805]
R56  200k  RESISTOR0805  [0805]
R57  100k  RESISTOR0805  [0805]
U13  LTC2361  [SOT65P280X100-8N]
U14  LDOAP2125  [SOT95P282X145-3N]
U15  LDO_ENAP7365  [SON65P201X201X63-7T86X155N]
U16  AP3417C  [SOT95P282X145-5N]
U19  FAN48610  [BGA9C40P3X3_121X121X58N]

### Nets
+1V2: C54.P$2 U15.4(OUT) ; also sheet 1,8
+1V8: C47.P$2 C48.P$2 C53.P$2 C56.P$2 L1.P$2 R45.P$1 R56.P$2 U13.2(VREF) U13.5(OVDD) U15.3(IN) ; also sheet 5,6,7,10
+3V3: C49.P$2 C52.P$2 U13.1(VDD) U14.2(OUT) ; also sheet 1,3,4,8
+3V7: C51.P$2 Q19.5(D) Q19.6(D) Q19.7(D) Q19.8(D) Q19.9(D) Q19.10(D) R46.P$2 R48.P$2 R50.P$2 R54.P$2 U14.3(IN) ; also sheet 2,4,5,7,9,11
+5V: C69.P$2 U19.A1(VOUT) U19.A2(VOUT) ; also sheet 8
ADC_CONV: U13.8(CONV)
ADC_SCK: U13.7(SCK)
ADC_SDO: U13.6(SDO)
GND: BT2.-1(-) BT2.-2(-) BT2.-3(-) C47.P$1 C48.P$1 C49.P$1 C51.P$1 C52.P$1 C53.P$1 C54.P$1 C55.P$1 C56.P$1 C69.P$1 C70.P$1 JP7.1 JP7.3 JP8.1 JP8.3 R49.P$1 R57.P$1 U13.3(GND) U14.1(GND) U15.2(GND) U15.7(GND) U16.2(GND) U19.C1(PGND) U19.C2(PGND) U19.C3(AGND) ; also sheet 1,2,3,4,5,6,7,8,9,10,11
N$73: R45.P$2 U15.1(EN)
N$80: R48.P$1 R49.P$2 U13.4(AIN)
N$84: R46.P$1 U16.1(EN)
N$86: L1.P$1 U16.3(LX)
N$87: R56.P$1 R57.P$2 U16.5(FB)
N$96: L7.P$1 U19.B1(SW) U19.B2(SW)
N$97: R54.P$1 U19.B3(EN)
ON: Q19.4(G) ; also sheet 10
VBAT: BT2.+1(+) BT2.+2(+) BT2.+3(+) C55.P$2 C70.P$2 JP7.2 JP8.2 L7.P$2 Q19.1(S) Q19.2(S) Q19.3(S) R50.P$1 U16.4(VIN) U19.A3(VIN) ; also sheet 10

## Power pins joined to a net without a drawn wire
+3V3: U2.1(+3V3) U2.17(+3V3)

## Library data of the parts
AE1 AE4 AE6 = Bulkhead Flight Computer:5-1814832-1
AE2 AE3 AE5 = Bulkhead Flight Computer:ANTENNA
BT1 BT2 = Bulkhead Flight Computer:18650
C1-C41 C44-C70 = Bulkhead Flight Computer:CAPACITOR
C42 C43 = Bulkhead Flight Computer:ELECTROLYTIC
D1 D2 = Bulkhead Flight Computer:LS56
D3-D6 = Bulkhead Flight Computer:LED
FL1 = Bulkhead Flight Computer:SAW
J1 = Bulkhead Flight Computer:USB
JP1 = Bulkhead Flight Computer:PINHD-1X8: PIN HEADER
JP2 JP3 JP5 = Bulkhead Flight Computer:PINHD-1X4: PIN HEADER
JP4 = Bulkhead Flight Computer:PINHD-1X7: PIN HEADER
JP6 = Bulkhead Flight Computer:PINHD-1X2: PIN HEADER
JP7 JP8 = Bulkhead Flight Computer:PINHD-1X3: PIN HEADER
L1-L7 = Bulkhead Flight Computer:INDUCTOR
LS1 = Bulkhead Flight Computer:PKM13EPYH4000-A0
P1 = Bulkhead Flight Computer:SDCARD
P5-P8 = Bulkhead Flight Computer:EJECTION_CHARGE
Q1 Q3 Q5 Q6 Q8 Q10-Q13 Q15-Q18 = Bulkhead Flight Computer:MMBT3904
Q2 Q4 Q9 = Bulkhead Flight Computer:BCV27: Trans Darlington NPN 30V 1.2A 350mW 3-Pin SOT-23 T/R
Q7 = Bulkhead Flight Computer:MMBT3906
Q14 = Bulkhead Flight Computer:PHOTOTRANSISTOR
Q19 = Bulkhead Flight Computer:P-MOSFET
Q20 = Bulkhead Flight Computer:TAV-541+
R1-R57 = Bulkhead Flight Computer:RESISTOR
TP1-TP11 = Bulkhead Flight Computer:TOUCH_POINT
U1 = Bulkhead Flight Computer:LFXP6E-3FN256C: FPGA LatticeXP Family 6000 Cells 320MHz 130nm Technology 1.2V 256-Pin FBGA Tray
U2 = Bulkhead Flight Computer:RPI-ZERO
U3 = Bulkhead Flight Computer:LSM6DS3
U4 = Bulkhead Flight Computer:MS5637-02BA03
U5 = Bulkhead Flight Computer:JF2
U6 U9 = Bulkhead Flight Computer:RFM69HCW
U7 = Bulkhead Flight Computer:ATMEGA328PB
U8 = Bulkhead Flight Computer:AT42QT1110
U10 = Bulkhead Flight Computer:LTV-357T
U11 = Bulkhead Flight Computer:LDO_ADJ
U12 U15 = Bulkhead Flight Computer:LDO_EN
U13 = Bulkhead Flight Computer:LTC2361
U14 = Bulkhead Flight Computer:LDO
U16 = Bulkhead Flight Computer:AP3417C
U17 = Bulkhead Flight Computer:GVA-91+
U18 = Bulkhead Flight Computer:MIC47050
U19 = Bulkhead Flight Computer:FAN48610
XTAL1 = Bulkhead Flight Computer:CRYSTAL
Y1 = Bulkhead Flight Computer:DSC1122B